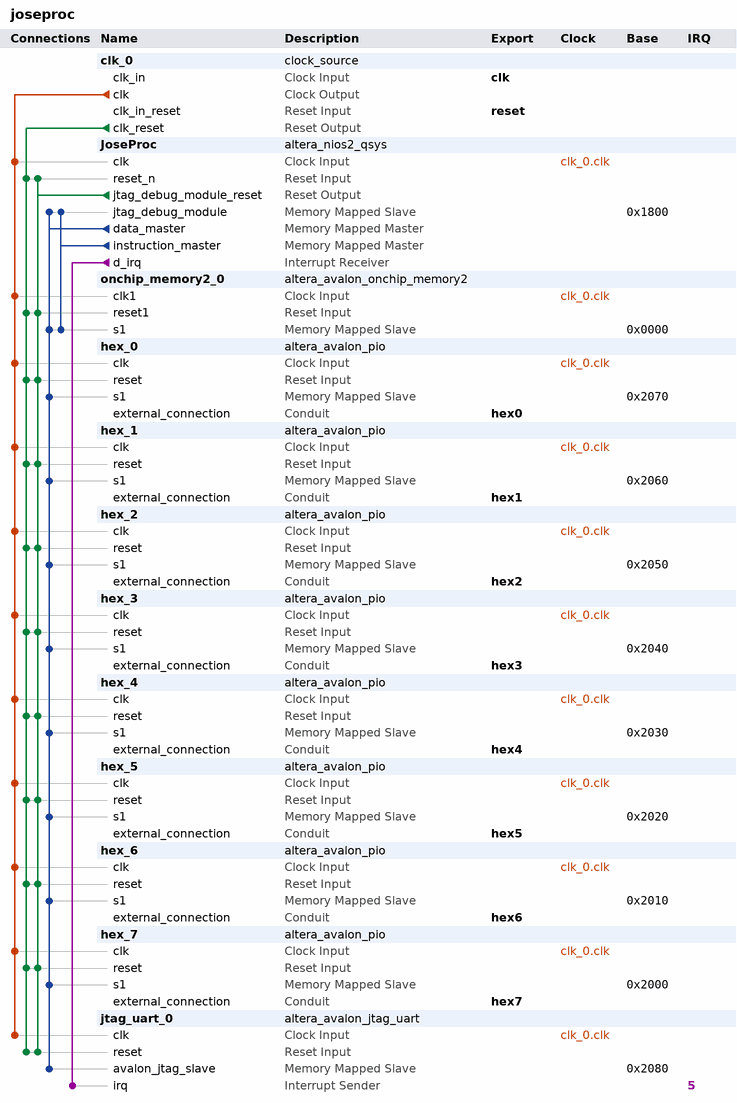
[diagram p0: system contents]
# Platform Designer (Qsys) system joseproc, Cyclone IV E EP4CE115F29C7
# Parameters at their usual value, and those the tool derives, are not listed.
package require -exact qsys 17.1
create_system joseproc
set_project_property DEVICE_FAMILY {Cyclone IV E}
set_project_property DEVICE EP4CE115F29C7

add_instance clk_0 clock_source 17.1
set_instance_parameter_value clk_0 clockFrequency 50000000

add_instance JoseProc altera_nios2_qsys 16.1
set_instance_parameter_value JoseProc breakSlave JoseProc.jtag_debug_module
set_instance_parameter_value JoseProc exceptionSlave onchip_memory2_0.s1
set_instance_parameter_value JoseProc icache_size 4096
set_instance_parameter_value JoseProc impl Tiny
set_instance_parameter_value JoseProc mmu_TLBMissExcSlave None
set_instance_parameter_value JoseProc resetSlave onchip_memory2_0.s1
set_instance_parameter_value JoseProc resetrequest_enabled true

add_instance onchip_memory2_0 altera_avalon_onchip_memory2 17.1
set_instance_parameter_value onchip_memory2_0 dataWidth 32
set_instance_parameter_value onchip_memory2_0 dualPort false
set_instance_parameter_value onchip_memory2_0 initMemContent true
set_instance_parameter_value onchip_memory2_0 initializationFileName onchip_mem.hex
set_instance_parameter_value onchip_memory2_0 memorySize 4096

add_instance hex_0 altera_avalon_pio 17.1
set_instance_parameter_value hex_0 direction Output
set_instance_parameter_value hex_0 width 7

add_instance hex_1 altera_avalon_pio 17.1
set_instance_parameter_value hex_1 direction Output
set_instance_parameter_value hex_1 width 7

add_instance hex_2 altera_avalon_pio 17.1
set_instance_parameter_value hex_2 direction Output
set_instance_parameter_value hex_2 width 7

add_instance hex_3 altera_avalon_pio 17.1
set_instance_parameter_value hex_3 direction Output
set_instance_parameter_value hex_3 width 7

add_instance hex_4 altera_avalon_pio 17.1
set_instance_parameter_value hex_4 direction Output
set_instance_parameter_value hex_4 width 7

add_instance hex_5 altera_avalon_pio 17.1
set_instance_parameter_value hex_5 direction Output
set_instance_parameter_value hex_5 width 7

add_instance hex_6 altera_avalon_pio 17.1
set_instance_parameter_value hex_6 direction Output
set_instance_parameter_value hex_6 width 7

add_instance hex_7 altera_avalon_pio 17.1
set_instance_parameter_value hex_7 direction Output
set_instance_parameter_value hex_7 width 7

add_instance jtag_uart_0 altera_avalon_jtag_uart 17.1
set_instance_parameter_value jtag_uart_0 simInteractiveOptions NO_INTERACTIVE_WINDOWS

# connections
add_connection clk_0.clk hex_0.clk clock
add_connection clk_0.clk hex_1.clk clock
add_connection clk_0.clk hex_2.clk clock
add_connection clk_0.clk hex_3.clk clock
add_connection clk_0.clk hex_4.clk clock
add_connection clk_0.clk hex_5.clk clock
add_connection clk_0.clk hex_6.clk clock
add_connection clk_0.clk hex_7.clk clock
add_connection clk_0.clk JoseProc.clk clock
add_connection clk_0.clk jtag_uart_0.clk clock
add_connection clk_0.clk onchip_memory2_0.clk1 clock
add_connection clk_0.clk_reset hex_0.reset reset
add_connection clk_0.clk_reset hex_1.reset reset
add_connection clk_0.clk_reset hex_2.reset reset
add_connection clk_0.clk_reset hex_3.reset reset
add_connection clk_0.clk_reset hex_4.reset reset
add_connection clk_0.clk_reset hex_5.reset reset
add_connection clk_0.clk_reset hex_6.reset reset
add_connection clk_0.clk_reset hex_7.reset reset
add_connection clk_0.clk_reset JoseProc.reset_n reset
add_connection clk_0.clk_reset jtag_uart_0.reset reset
add_connection clk_0.clk_reset onchip_memory2_0.reset1 reset
add_connection JoseProc.jtag_debug_module_reset hex_0.reset reset
add_connection JoseProc.jtag_debug_module_reset hex_1.reset reset
add_connection JoseProc.jtag_debug_module_reset hex_2.reset reset
add_connection JoseProc.jtag_debug_module_reset hex_3.reset reset
add_connection JoseProc.jtag_debug_module_reset hex_4.reset reset
add_connection JoseProc.jtag_debug_module_reset hex_5.reset reset
add_connection JoseProc.jtag_debug_module_reset hex_6.reset reset
add_connection JoseProc.jtag_debug_module_reset hex_7.reset reset
add_connection JoseProc.jtag_debug_module_reset JoseProc.reset_n reset
add_connection JoseProc.jtag_debug_module_reset jtag_uart_0.reset reset
add_connection JoseProc.jtag_debug_module_reset onchip_memory2_0.reset1 reset
add_connection JoseProc.data_master hex_0.s1 avalon
set_connection_parameter_value JoseProc.data_master/hex_0.s1 baseAddress 0x2070
add_connection JoseProc.data_master hex_1.s1 avalon
set_connection_parameter_value JoseProc.data_master/hex_1.s1 baseAddress 0x2060
add_connection JoseProc.data_master hex_2.s1 avalon
set_connection_parameter_value JoseProc.data_master/hex_2.s1 baseAddress 0x2050
add_connection JoseProc.data_master hex_3.s1 avalon
set_connection_parameter_value JoseProc.data_master/hex_3.s1 baseAddress 0x2040
add_connection JoseProc.data_master hex_4.s1 avalon
set_connection_parameter_value JoseProc.data_master/hex_4.s1 baseAddress 0x2030
add_connection JoseProc.data_master hex_5.s1 avalon
set_connection_parameter_value JoseProc.data_master/hex_5.s1 baseAddress 0x2020
add_connection JoseProc.data_master hex_6.s1 avalon
set_connection_parameter_value JoseProc.data_master/hex_6.s1 baseAddress 0x2010
add_connection JoseProc.data_master hex_7.s1 avalon
set_connection_parameter_value JoseProc.data_master/hex_7.s1 baseAddress 0x2000
add_connection JoseProc.data_master JoseProc.jtag_debug_module avalon
set_connection_parameter_value JoseProc.data_master/JoseProc.jtag_debug_module baseAddress 0x1800
add_connection JoseProc.data_master jtag_uart_0.avalon_jtag_slave avalon
set_connection_parameter_value JoseProc.data_master/jtag_uart_0.avalon_jtag_slave baseAddress 0x2080
add_connection JoseProc.data_master onchip_memory2_0.s1 avalon
set_connection_parameter_value JoseProc.data_master/onchip_memory2_0.s1 baseAddress 0x0000
add_connection JoseProc.instruction_master JoseProc.jtag_debug_module avalon
set_connection_parameter_value JoseProc.instruction_master/JoseProc.jtag_debug_module baseAddress 0x1800
add_connection JoseProc.instruction_master onchip_memory2_0.s1 avalon
set_connection_parameter_value JoseProc.instruction_master/onchip_memory2_0.s1 baseAddress 0x0000
add_connection JoseProc.d_irq jtag_uart_0.irq interrupt
set_connection_parameter_value JoseProc.d_irq/jtag_uart_0.irq irqNumber 5

# exported interfaces
add_interface clk clock sink
set_interface_property clk EXPORT_OF clk_0.clk_in
add_interface hex0 conduit end
set_interface_property hex0 EXPORT_OF hex_0.external_connection
add_interface hex1 conduit end
set_interface_property hex1 EXPORT_OF hex_1.external_connection
add_interface hex2 conduit end
set_interface_property hex2 EXPORT_OF hex_2.external_connection
add_interface hex3 conduit end
set_interface_property hex3 EXPORT_OF hex_3.external_connection
add_interface hex4 conduit end
set_interface_property hex4 EXPORT_OF hex_4.external_connection
add_interface hex5 conduit end
set_interface_property hex5 EXPORT_OF hex_5.external_connection
add_interface hex6 conduit end
set_interface_property hex6 EXPORT_OF hex_6.external_connection
add_interface hex7 conduit end
set_interface_property hex7 EXPORT_OF hex_7.external_connection
add_interface reset reset sink
set_interface_property reset EXPORT_OF clk_0.clk_in_reset

set_interconnect_requirement {$system} qsys_mm.clockCrossingAdapter HANDSHAKE
set_interconnect_requirement {$system} qsys_mm.enableEccProtection FALSE
set_interconnect_requirement {$system} qsys_mm.insertDefaultSlave FALSE
set_interconnect_requirement {$system} qsys_mm.maxAdditionalLatency 1

save_system joseproc.qsys
